# EAGLE schematic OBI_SlaveBoard_rev3 (EAGLE 7.2.0)
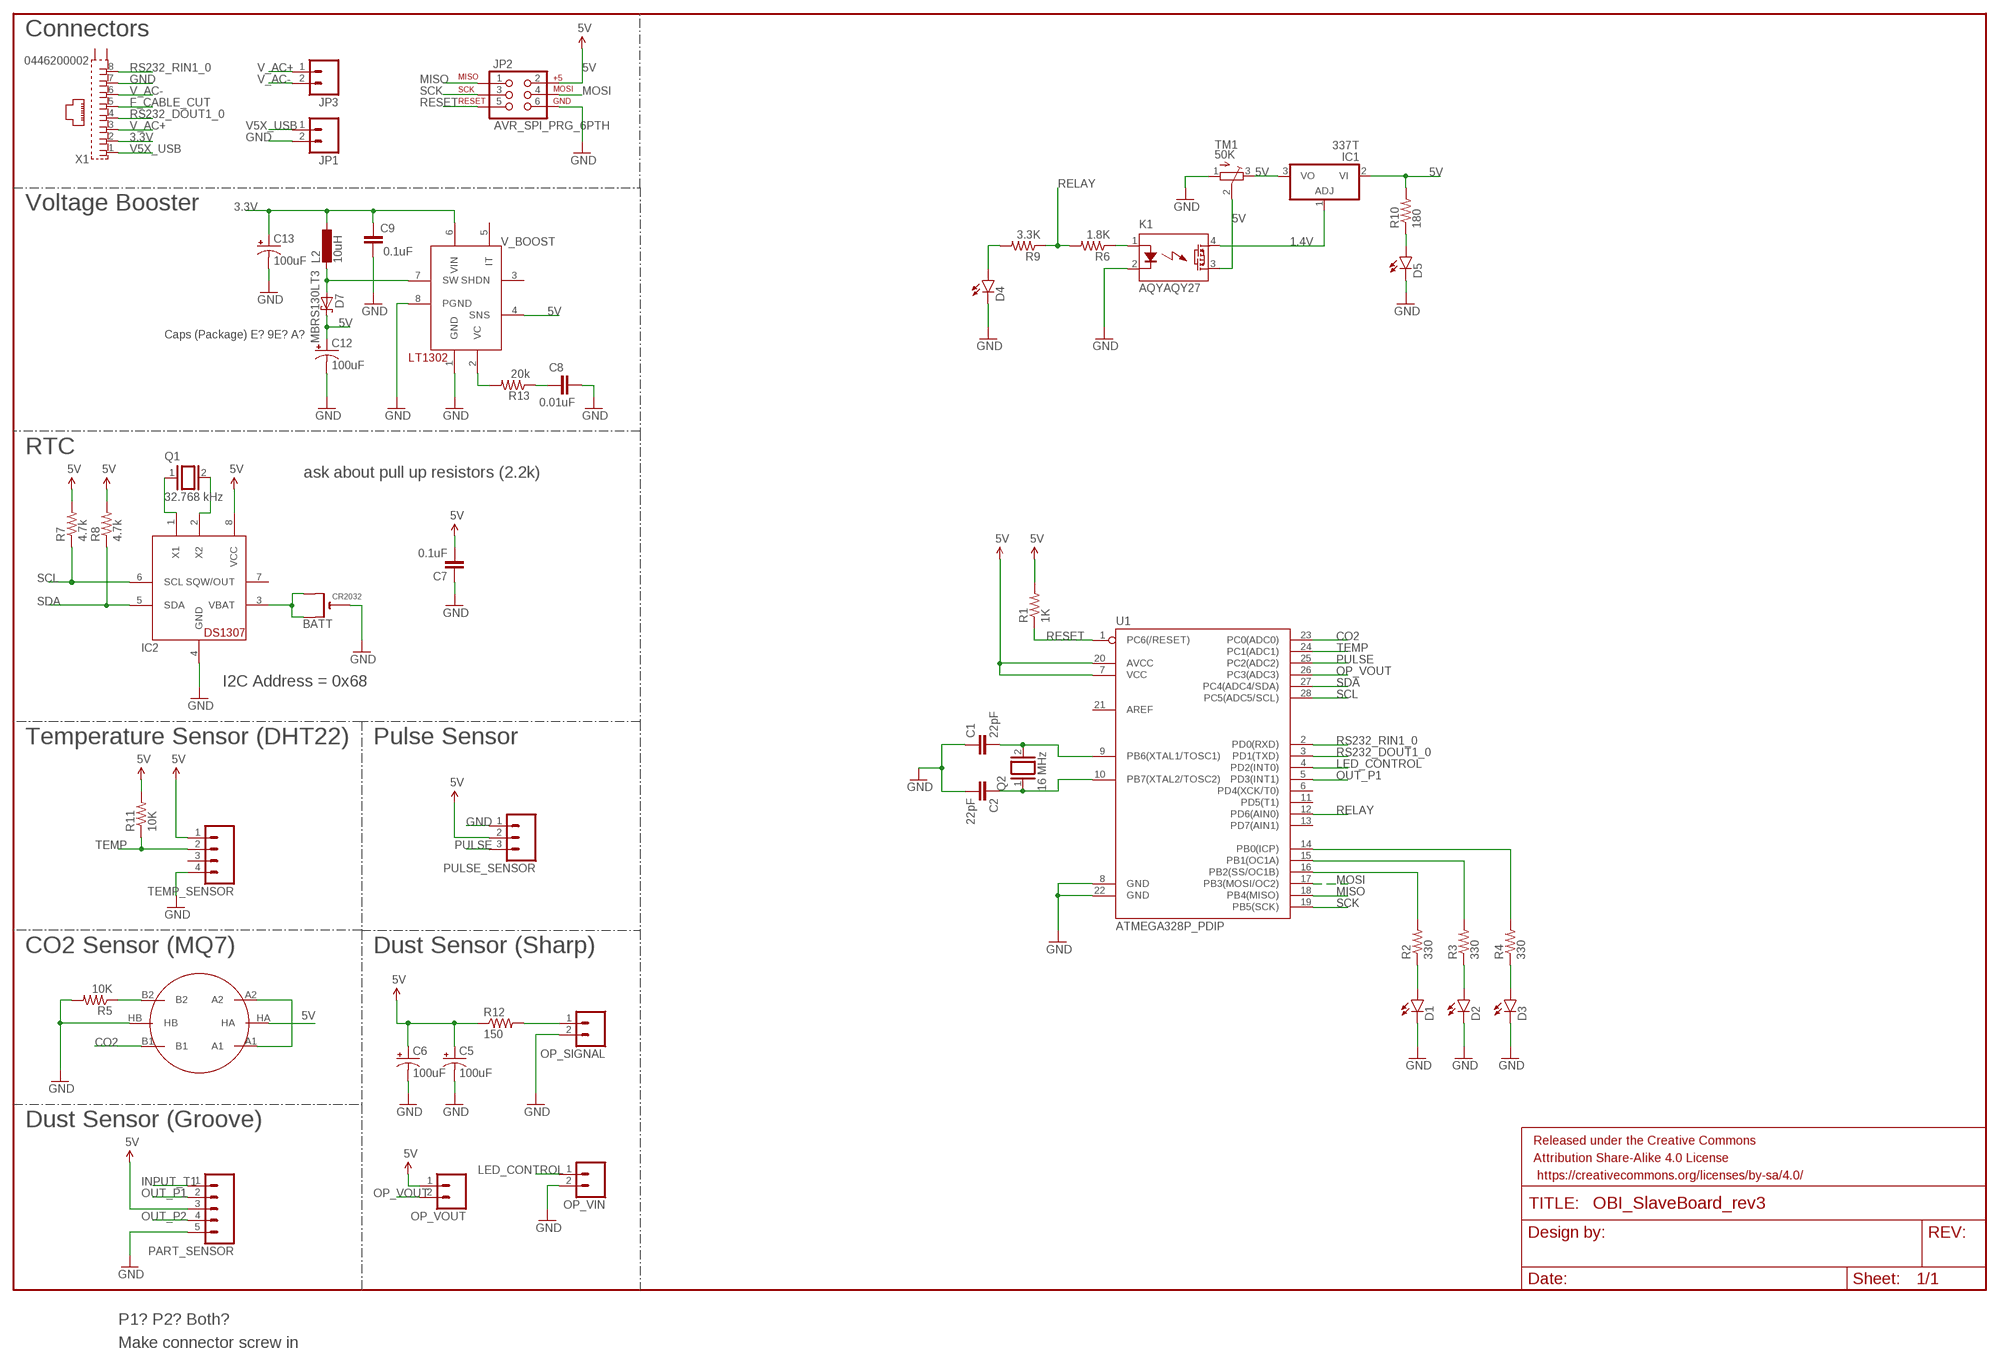
[diagram p0: schematic, sheet 1]

## Parts
BATT  CR2032THM  [CR2032-THRU]
C1  22pF  CAPKIT  [CAP-PTH-SMALL-KIT]
C2  22pF  CAPKIT  [CAP-PTH-SMALL-KIT]
C5  100uF  CAP_POLPTH2  [CPOL-RADIAL-10UF-25V]
C6  100uF  CAP_POLPTH2  [CPOL-RADIAL-10UF-25V]
C7  0.1uF  CAPKIT  [CAP-PTH-SMALL-KIT]
C8  0.01uF  CAPKIT  [CAP-PTH-SMALL-KIT]
C9  0.1uF  CAPKIT  [CAP-PTH-SMALL-KIT]
C12  100uF  CPOL-USSANYO_9E  [SANYO-OSCON_9E]
C13  100uF  CPOL-USSANYO_9E  [SANYO-OSCON_9E]
CO2_SENSOR  METHANE_SENSOR  [MQ-3]
D1  LED5MM  [LED5MM]
D2  LED5MM  [LED5MM]
D3  LED5MM  [LED5MM]
D4  LED5MM  [LED5MM]
D5  LED5MM  [LED5MM]
D7  MBRS130LT3  [SMB]
FRAME1  FRAME-LEDGER  [CREATIVE_COMMONS]
IC1  337T  [TO220H]
IC2  DS1307  [DIL08]
JP1  M023.5MM  [SCREWTERMINAL-3.5MM-2]
JP2  AVR_SPI_PRG_6PTH  [2X3]
JP3  M023.5MM  [SCREWTERMINAL-3.5MM-2]
K1  AQYAQY27  [AQY27]
L2  10uH  DO3316P  [DO3316P]
OP_SIGNAL  M023.5MM  [SCREWTERMINAL-3.5MM-2]
OP_VIN  M023.5MM  [SCREWTERMINAL-3.5MM-2]
OP_VOUT  M023.5MM  [SCREWTERMINAL-3.5MM-2]
PART_SENSOR  M05JST  [JST-5-PTH]
PULSE_SENSOR  M03-SCREW-5MM  [SCREWTERMINAL-5MM-3]
Q1  32.768 kHz  XTAL/S  [QS]
Q2  16 MHz  XTAL/S  [QS]
R1  1K  RESISTORPTH-1/4W  [AXIAL-0.4]
R2  330  RESISTORPTH-1/4W  [AXIAL-0.4]
R3  330  RESISTORPTH-1/4W  [AXIAL-0.4]
R4  330  RESISTORPTH-1/4W  [AXIAL-0.4]
R5  10K  RESISTORPTH-1/4W  [AXIAL-0.4]
R6  1.8K  RESISTORPTH-1/4W  [AXIAL-0.4]
R7  4.7k  RESISTORPTH-1/4W  [AXIAL-0.4]
R8  4.7k  RESISTORPTH-1/4W  [AXIAL-0.4]
R9  3.3K  RESISTORPTH-1/4W  [AXIAL-0.4]
R10  180  RESISTORPTH-1/4W  [AXIAL-0.4]
R11  10K  RESISTORPTH-1/4W  [AXIAL-0.4]
R12  150  RESISTORPTH-1/4W  [AXIAL-0.4]
R13  20k  RESISTORPTH-1/4W  [AXIAL-0.4]
TEMP_SENSOR  M04SCREW  [SCREWTERMINAL-3.5MM-4]
TM1  50K  TRIMPOTTC33X  [TC33X]
U1  ATMEGA328P_PDIP  [DIL28-3]
V_BOOST  LT1302  [DIL08]
X1  0446200002  [0446200002]

## Nets
1.4V: IC1.1(ADJ) K1.4(DS1)
3.3V: C9.1 C13.+ L2.2 V_BOOST.6(VIN) X1.2
5V: C5.1(+) C6.1(+) C7.2 C12.+ CO2_SENSOR.HA D7.C IC1.2(VI) IC1.3(VO) IC2.8(VCC) JP2.2 K1.3(DS2) OP_VOUT.1 PART_SENSOR.3 PULSE_SENSOR.2 R1.P$2 R7.P$2 R8.P$2 R10.P$2 R11.P$2 R12.P$1 TEMP_SENSOR.1 TM1.2(S) TM1.3(E) U1.7(VCC) U1.20(AVCC) V_BOOST.4(SNS)
CO2: CO2_SENSOR.B1 U1.23(PC0(ADC0))
F_CABLE_CUT: X1.5
GND: BATT.- C1.1 C2.2 C5.2(-) C6.2(-) C7.1 C8.1 C9.2 C12.- C13.- CO2_SENSOR.HB D1.K(C) D2.K(C) D3.K(C) D4.K(C) D5.K(C) IC2.4(GND) JP1.2 JP2.6 K1.2(K) OP_SIGNAL.2 OP_VIN.2 PART_SENSOR.5 PULSE_SENSOR.1 R5.P$2 TEMP_SENSOR.4 TM1.1(A) U1.8(GND) U1.22(GND) V_BOOST.1(GND) V_BOOST.8(PGND) X1.7
INPUT_T1: PART_SENSOR.1
LED_CONTROL: OP_VIN.1 U1.4(PD2(INT0))
MISO: JP2.1 U1.18(PB4(MISO))
MOSI: JP2.4 U1.17(PB3(MOSI/OC2))
N$1: D5.A R10.P$1
N$2: K1.1(A) R6.P$1
N$3: C1.2 Q2.2 U1.9(PB6(XTAL1/TOSC1))
N$5: BATT.+1(+) BATT.+2(+1) IC2.3(VBAT)
N$6: IC2.1(X1) Q1.1
N$7: IC2.2(X2) Q1.2
N$8: R2.P$2 U1.16(PB2(SS/OC1B))
N$9: D1.A R2.P$1
N$10: R3.P$2 U1.15(PB1(OC1A))
N$11: D2.A R3.P$1
N$12: R4.P$2 U1.14(PB0(ICP))
N$13: D3.A R4.P$1
N$14: R13.P$2 V_BOOST.2(VC)
N$15: CO2_SENSOR.A1 CO2_SENSOR.A2
N$16: C2.1 Q2.1 U1.10(PB7(XTAL2/TOSC2))
N$17: CO2_SENSOR.B2 R5.P$1
N$18: C8.2 R13.P$1
N$19: D4.A R9.P$2
N$20: OP_SIGNAL.1 R12.P$2
N$22: D7.A L2.1 V_BOOST.7(SW)
OP_VOUT: OP_VOUT.2 U1.26(PC3(ADC3))
OUT_P1: PART_SENSOR.2 U1.5(PD3(INT1))
OUT_P2: PART_SENSOR.4
PULSE: PULSE_SENSOR.3 U1.25(PC2(ADC2))
RELAY: R6.P$2 R9.P$1 U1.12(PD6(AIN0))
RESET: JP2.5 R1.P$1 U1.1(PC6(/RESET))
RS232_DOUT1_0: U1.3(PD1(TXD)) X1.4
RS232_RIN1_0: U1.2(PD0(RXD)) X1.8
SCK: JP2.3 U1.19(PB5(SCK))
SCL: IC2.6(SCL) R7.P$1 U1.28(PC5(ADC5/SCL))
SDA: IC2.5(SDA) R8.P$1 U1.27(PC4(ADC4/SDA))
TEMP: R11.P$1 TEMP_SENSOR.2 U1.24(PC1(ADC1))
V5X_USB: JP1.1 X1.1
V_AC+: JP3.1 X1.3
V_AC-: JP3.2 X1.6
Unconnected: IC2.7(SQW/OUT) TEMP_SENSOR.3 U1.6(PD4(XCK/T0)) U1.11(PD5(T1)) U1.13(PD7(AIN1)) U1.21(AREF) V_BOOST.3(SHDN) V_BOOST.5(IT) X1.S@1(S1) X1.S@2(S2)

## Notes on the sheet
- Connectors
- Voltage Booster
- Caps (Package) E? 9E? A?
- RTC
- ask about pull up resistors (2.2k)
- I2C Address = 0x68
- Temperature Sensor (DHT22) | Pulse Sensor
- CO2 Sensor (MQ7) | Dust Sensor (Sharp)
- Dust Sensor (Groove)
- P1? P2? Both?
- Make connector screw in

## Library data of the parts
BATT = adafruit:CR2032
C1 C2 C7-C9 = SparkFun-Passives:CAP: Capacitor Standard 0603 ceramic capacitor, and 0.1" leaded capacitor.
C5 C6 = SparkFun-Capacitors:CAP_POL: Capacitor Polarized These are standard SMD and PTH capacitors. Normally 10uF, 47uF, and 100uF in electrolytic and tantalum varieties. Always verify the external diameter of the through hole cap, it varies with capacity, voltage, and manufacturer. The EIA devices should be standard.
C12 C13 = rcl:CPOL-US: POLARIZED CAPACITOR, American symbol
CO2_SENSOR = SparkFun-Sensors:METHANE_SENSOR: MQ-4 Methane Gas Sensor SEN-09404
D1-D5 = SparkFun-LED:LED: LEDs Standard schematic elements and footprints for 5mm, 3mm, 1206, and 0603 sized LEDs. 5mm - Spark Fun Electronics SKU : COM-00529 (and others)
D7 = diode:MBRS130LT3: Schottky Power Rectifier Source: http://www.onsemi.com/pub/Collateral/MBRS130LT3-D.PDF
FRAME1 = SparkFun-Aesthetics:FRAME-LEDGER: Schematic Frame Standard 11x14 US Ledger frame
IC1 = linear:*337: Negative VOLTAGE REGULATOR
IC2 = adafruit:DS1307: DS1307 Real time clock (RTC) with battery backup ability. Talk to it via i2c
JP1 JP3 OP_SIGNAL OP_VIN OP_VOUT = SparkFun-Connectors:M02: Standard 2-pin 0.1" header. Use with - straight break away headers ( PRT-00116) - right angle break away headers (PRT-00553) - swiss pins (PRT-00743) - machine pins (PRT-00117) - female headers (PRT-00115) Molex polarized connector foot print use with: PRT-08233 with associated crimp pins and housings. 2.54_SCREWTERM for use with PRT-10571. 3.5mm Screw Terminal footprints for PRT-08084 5mm Screw Terminal footprints for use with PRT-08432; PROD_ID: CONN-08399
JP2 = SparkFun-Connectors:AVR_SPI_PRG_6: AVR ISP 6 Pin This is the reduced ISP connector for AVR programming. Common on Arduino. This footprint will take up less PCB space and can be used with a 10-pin to 6-pin adapter such as SKU: BOB-08508 **Special note about "TEST_POINT" package. The stop mask is on the top side, so if you want your programming test points to be on the bottom of your board, make sure to place this package on the bottom side of the board. This also ensure that the orientation to program from the bottom side will be correct.
K1 = relay:AQY*: PhotoMOS Relay NAiS Source: http://www.panasonic-electric-works.com/catalogues/downloads/photomos/ds_x615_en_aqz10_20.pdf; OC_FARNELL: unknown; OC_NEWARK: unknown
L2 = inductor-coilcraft:DO3316P: COILCRAFT; OC_FARNELL: unknown; OC_NEWARK: unknown
PART_SENSOR = SparkFun-Connectors:M05: Header 5 Standard 5-pin 0.1" header. Use with straight break away headers (SKU : PRT-00116), right angle break away headers (PRT-00553), swiss pins (PRT-00743), machine pins (PRT-00117), and female headers (PRT-00115). Molex polarized connector foot print use with SKU : PRT-08230 with associated crimp pins and housings.
PULSE_SENSOR = SparkFun-Connectors:M03: Header 3 Standard 3-pin 0.1" header. Use with straight break away headers (SKU : PRT-00116), right angle break away headers (PRT-00553), swiss pins (PRT-00743), machine pins (PRT-00117), and female headers (PRT-00115). Molex polarized connector foot print use with SKU : PRT-08232 with associated crimp pins and housings.; STOREFRONT_ID: PRT-08433
Q1 Q2 = special:XTAL/S: CRYSTAL
R1 R5-R9 = SparkFun-Passives:RESISTOR: Resistor Basic schematic elements and footprints for 0603, 1206, and PTH resistors.
R2-R4 R10-R13 = SparkFun-Resistors:RESISTOR: Resistor Basic schematic elements and footprints for 0603, 1206, and PTH resistors.
TEMP_SENSOR = SparkFun-Connectors:M04: Header 4 Standard 4-pin 0.1" header. Use with straight break away headers (SKU : PRT-00116), right angle break away headers (PRT-00553), swiss pins (PRT-00743), machine pins (PRT-00117), and female headers (PRT-00115). Molex polarized connector foot print use with SKU : PRT-08231 with associated crimp pins and housings. 1MM SMD Version SKU: PRT-10208
TM1 = adafruit:TRIMPOT: SMT trimmer potentiometer part number TC33X http://www.ladyada.net/library/eagle
U1 = SparkFun-DigitalIC:ATMEGA328P_PDIP: uC used in the Arduino 32kb flash, 1k EEPROM, 2k SRAM This is the through-hole version of this chip.
V_BOOST = adafruit:LT1302
X1 = con-molex:0446200002: RJ-45 INVERTED MODULAR JACK ASSEMBLY WITH RJ-11 KEEPOUT FEATURE Source: Data sheet <http://www.farnell.com/datasheets/73207.pdf> MOLEX 0446200002 BUCHSE, RJ45, GESCHIRMT Source: Farnell <http://de.farnell.com/molex/0446200002/buchse-rj45-geschirmt/dp/9251910?ost=9251910>; MF: MOLEX; MPN: 0446200002; OC_FARNELL: 9251910